# Altium schematic sheet e3_tp2_ej2.SchDoc
size A
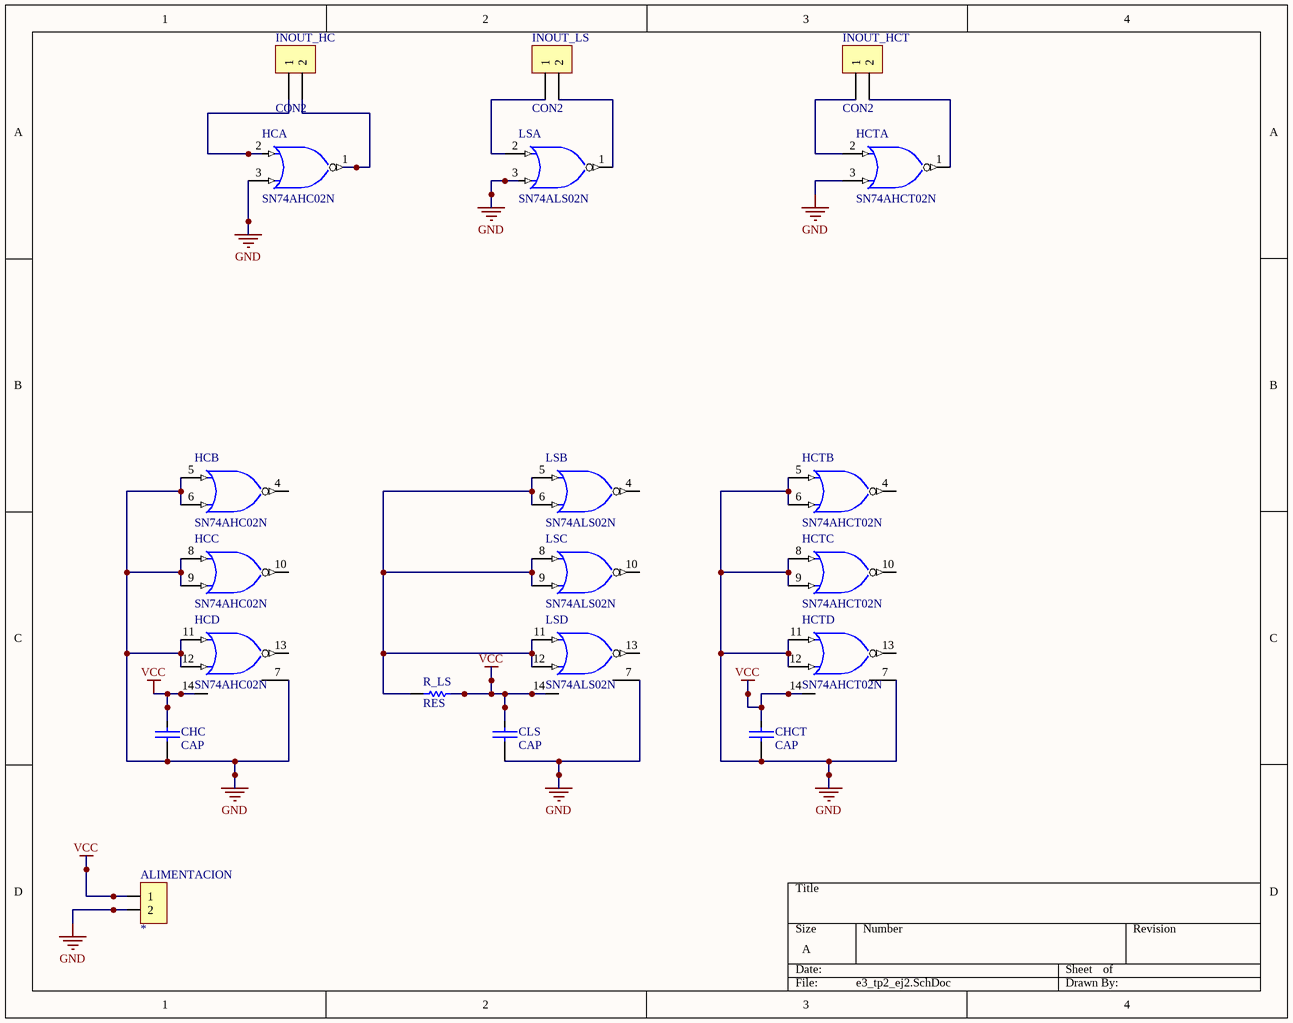
[diagram p0: e3_tp2_ej2.SchDoc]

## Parts
ALIMENTACION  *  [SIP2]
CHC  CAP  [CAP200]
CHCT  CAP  [CAP200]
CLS  CAP  [CAP200]
HC  SN74AHC02N  [N014]  (parts A,B,C,D of 4)
HCT  SN74AHCT02N  [N014]  (parts A,B,C,D of 4)
INOUT_HC  CON2  [SIP2]
INOUT_HCT  CON2  [SIP2]
INOUT_LS  CON2  [SIP2]
LS  SN74ALS02N  [N014]  (parts A,B,C,D of 4)
R_LS  RES  [RES300]

## Nets
GND: ALIMENTACION.2 CHC.2 CHCT.2 CLS.2 HC.3(B) HC.5(A) HC.6(B) HC.7(GND) HC.8(A) HC.9(B) HC.11(A) HC.12(B) HCT.3(B) HCT.5(A) HCT.6(B) HCT.7(GND) HCT.8(A) HCT.9(B) HCT.11(A) HCT.12(B) LS.3(B) LS.7(GND)
VCC: ALIMENTACION.1 CHC.1 CHCT.1 CLS.1 HC.14(VCC) HCT.14(VCC) LS.14(VCC) R_LS.2
NetHC_1: HC.1(Y) INOUT_HC.2
NetHC_2: HC.2(A) INOUT_HC.1
NetHCT_1: HCT.1(Y) INOUT_HCT.2
NetHCT_2: HCT.2(A) INOUT_HCT.1
NetINOUT_LS_1: INOUT_LS.1 LS.2(A)
NetINOUT_LS_2: INOUT_LS.2 LS.1(Y)
NetLS_5: LS.5(A) LS.6(B) LS.8(A) LS.9(B) LS.11(A) LS.12(B) R_LS.1

Not connected (* = marked no-connect by the designer): HC 4(Y) 10(Y) 13(Y); HCT 4(Y) 10(Y) 13(Y); LS 4(Y) 10(Y) 13(Y)

## Library data of the parts
ALIMENTACION = CON2
HC = SN74AHC02N: Quadruple 2-Input Positive-NOR Gate; Published: 8-Jun-2000; LatestRevisionDate: 04-Mar-2005; LatestRevisionNote: Stylized 3D Model Added.; DatasheetVersion: Apr-1999; PackageVersion: Oct-1995; PackageReference: N014; Publisher: Altium Limited; PackageDescription: DIP; 14 Leads; Row Spacing 7.62 mm; Pitch 2.54 mm; ComponentLink1Description: Manufacturer Link; ComponentLink1URL: http://www.ti.com/; ComponentLink2Description: Datasheet; ComponentLink2URL: http://www-s.ti.com/sc/ds/sn74ahc02.pdf; ComponentLink3Description: Packaging Specification; ComponentLink3URL: http://focus.ti.com/lit/ml/mpdi002c/mpdi002c.pdf
HCT = SN74AHCT02N: Quadruple 2-Input Positive-NOR Gate; Published: 8-Jun-2000; LatestRevisionDate: 04-Mar-2005; LatestRevisionNote: Stylized 3D Model Added.; DatasheetVersion: Apr-1999; PackageVersion: Oct-1995; PackageReference: N014; Publisher: Altium Limited; PackageDescription: DIP; 14 Leads; Row Spacing 7.62 mm; Pitch 2.54 mm; ComponentLink1Description: Manufacturer Link; ComponentLink1URL: http://www.ti.com/; ComponentLink2Description: Datasheet; ComponentLink2URL: http://www-s.ti.com/sc/ds/sn74ahct02.pdf; ComponentLink3Description: Packaging Specification; ComponentLink3URL: http://focus.ti.com/lit/ml/mpdi002c/mpdi002c.pdf
LS = SN74ALS02N: Quadruple 2-Input Positive-NOR Gate; Published: 8-Jun-2000; LatestRevisionDate: 04-Mar-2005; LatestRevisionNote: Stylized 3D Model Added.; DatasheetVersion: Jan-1994; PackageVersion: Oct-1995; PackageReference: N014; Publisher: Altium Limited; PackageDescription: DIP; 14 Leads; Row Spacing 7.62 mm; Pitch 2.54 mm; ComponentLink1Description: Manufacturer Link; ComponentLink1URL: http://www.ti.com/; ComponentLink2Description: Packaging Specification; ComponentLink2URL: http://focus.ti.com/lit/ml/mpdi002c/mpdi002c.pdf